# EAGLE design CS-O-BLINKER (EAGLE 6.4)
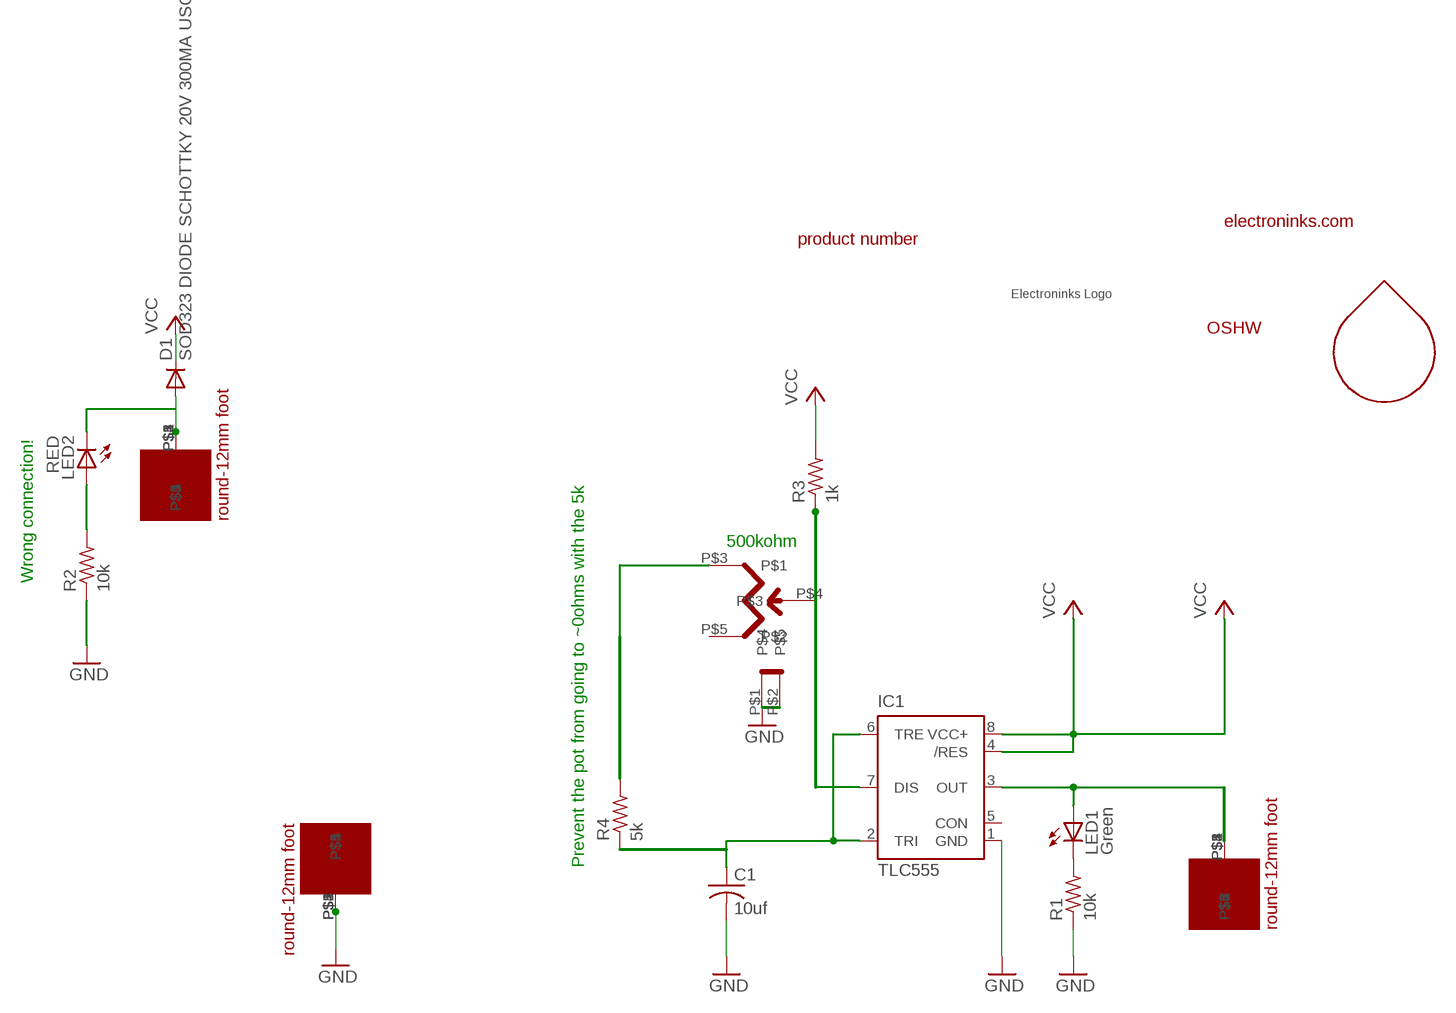
[diagram p0: schematic, sheet 1]

## Parts
C1  10uf  C-USC1206  [C1206]
D1  SOD323 DIODE SCHOTTKY 20V 300MA USC  DIODESOD  [SOD-323]
IC1  TLC555  NE555D  [SO08]
LED1  Green  LEDCHIP-LED0805  [CHIP-LED0805]
LED2  RED  LEDCHIP-LED0805  [CHIP-LED0805]
R1  10k  R-US_R0603  [R0603]
R2  10k  R-US_R0603  [R0603]
R3  1k  R-US_R0603  [R0603]
R4  5k  R-US_R0603  [R0603]
U$1  ROUND-12MM-FOOT-1.8MM  [ROUND-12MM-FOOT]
U$2  ROUND-12MM-FOOT-1.8MM  [ROUND-12MM-FOOT]
U$3  ROUND-12MM-FOOT-1.8MM  [ROUND-12MM-FOOT]
U$4  WH141-THUMB-POT-500K  [WH0141]
U$5  ELECTRONINKS_LOGO_10MM  [ELECTRONINKS_LOGO_10MM]
U$6  DROPLET_LOGO_3MM  [DROPLET_LOGO_3MM]
U$7  ELECTRONINKS_COM_15MM  [ELECTRONINKS_COM_15MM]
U$8  OSHW_3MM  [OSHW_3MM]
U$9  CS_N_BLINKER  [CS_N_BLINKER]

## Nets
GND: C1.2 IC1.1(GND) R1.1 R2.1 U$2.P$1 U$2.P$2 U$2.P$3 U$2.P$4 U$2.P$5 U$4.P$1 U$4.P$2
N$1: IC1.7(DIS) R3.1 U$4.P$4
N$2: C1.1 IC1.2(TRI) IC1.6(TRE) R4.1
N$3: IC1.3(OUT) LED1.A U$3.P$1 U$3.P$2 U$3.P$3 U$3.P$4 U$3.P$5
N$4: LED2.A R2.2
N$5: LED1.C R1.2
N$6: R4.2 U$4.P$3
N$7: D1.2(A) LED2.C U$1.P$1 U$1.P$2 U$1.P$3 U$1.P$4 U$1.P$5
VCC: D1.1(C) IC1.4(/RES) IC1.8(VCC+) R3.2
Unconnected: IC1.5(CON) U$4.P$5

## Notes on the sheet
- 500kohm
- Wrong connection!
- Prevent the pot from going to ~0ohms with the 5k

## Library data of the parts
C1 = resistor:C-US: CAPACITOR, American symbol
D1 = SparkFun-DiscreteSemi:DIODE: Diode These are standard reverse protection diodes and small signal diodes. SMA package can handle up to about 1A. SOD-323 can handle about 200mA. What the SOD-323 package when ordering, there are some mfgs out there that are 5-pin packages.; PROD_ID: DIO-09646
IC1 = SparkFun-AnalogIC:NE555: General purpose bipolar Timer
LED1 LED2 = led:LED: LED OSRAM: - CHIPLED LG R971, LG N971, LY N971, LG Q971, LY Q971, LO R971, LY R971 LH N974, LH R974 LS Q976, LO Q976, LY Q976 LO Q996 - Hyper CHIPLED LW Q18S LB Q993, LB Q99A, LB R99A - SideLED LS A670, LO A670, LY A670, LG A670, LP A670 LB A673, LV A673, LT A673, LW A673 LH A674 LY A675 LS A676, LA A676, LO A676, LY A676, LW A676 LS A679, LY A679, LG A679 - Hyper Micro SIDELED® LS Y876, LA Y876, LO Y876, LY Y876 LT Y87S - SmartLED LW L88C, LW L88S LB L89C, LB L89S, LG L890 LS L89K, LO L89K, LY L89K LS L896, LA L896, LO L896, LY L896 - TOPLED LS T670, LO T670, LY T670, LG T670, LP T670 LSG T670, LSP T670, LSY T670, LOP T670, LYG T670 LG T671, LOG T671, LSG T671 LB T673, LV T673, LT T673, LW T673 LH T674 LS T676, LA T676, LO T676, LY T676, LB T676, LH T676, LSB T676, LW T676 LB T67C, LV T67C, LT T67C, LS T67K, LO T67K, LY T67K, LW E67C LS E67B, LA E67B, LO E67B, LY E67B, LB E67C, LV E67C, LT E67C LW T67C LS T679, LY T679, LG T679 LS T770, LO T770, LY T770, LG T770, LP T770 LB T773, LV T773, LT T773, LW T773 LH T774 LS E675, LA E675, LY E675, LS T675 LS T776, LA T776, LO T776, LY T776, LB T776 LHGB T686 LT T68C, LB T68C - Hyper Mini TOPLED® LB M676 - Mini TOPLED Santana® LG M470 LS M47K, LO M47K, LY M47K Source: http://www.osram.convergy.de LUXEON: - LUMILED® LXK2-PW12-R00, LXK2-PW12-S00, LXK2-PW14-U00, LXK2-PW14-V00 LXK2-PM12-R00, LXK2-PM12-S00, LXK2-PM14-U00 LXK2-PE12-Q00, LXK2-PE12-R00, LXK2-PE12-S00, LXK2-PE14-T00, LXK2-PE14-U00 LXK2-PB12-K00, LXK2-PB12-L00, LXK2-PB12-M00, LXK2-PB14-N00, LXK2-PB14-P00, LXK2-PB14-Q00 LXK2-PR12-L00, LXK2-PR12-M00, LXK2-PR14-Q00, LXK2-PR14-R00 LXK2-PD12-Q00, LXK2-PD12-R00, LXK2-PD12-S00 LXK2-PH12-R00, LXK2-PH12-S00 LXK2-PL12-P00, LXK2-PL12-Q00, LXK2-PL12-R00 Source: www.luxeon.com KINGBRIGHT: KA-3528ASYC Source: www.kingbright.com
R1-R4 = resistor:R-US_: RESISTOR, American symbol
U$1-U$3 = electroninks:ROUND-12MM-FOOT-1.8MM
U$4 = electroninks:WH141-THUMB-POT-500K
U$5 = electroninks:ELECTRONINKS_LOGO_10MM
U$6 = electroninks:DROPLET_LOGO_3MM
U$7 = electroninks:ELECTRONINKS_COM_15MM
U$8 = electroninks:OSHW_3MM
U$9 = electroninks:CS_N_BLINKER

## Board
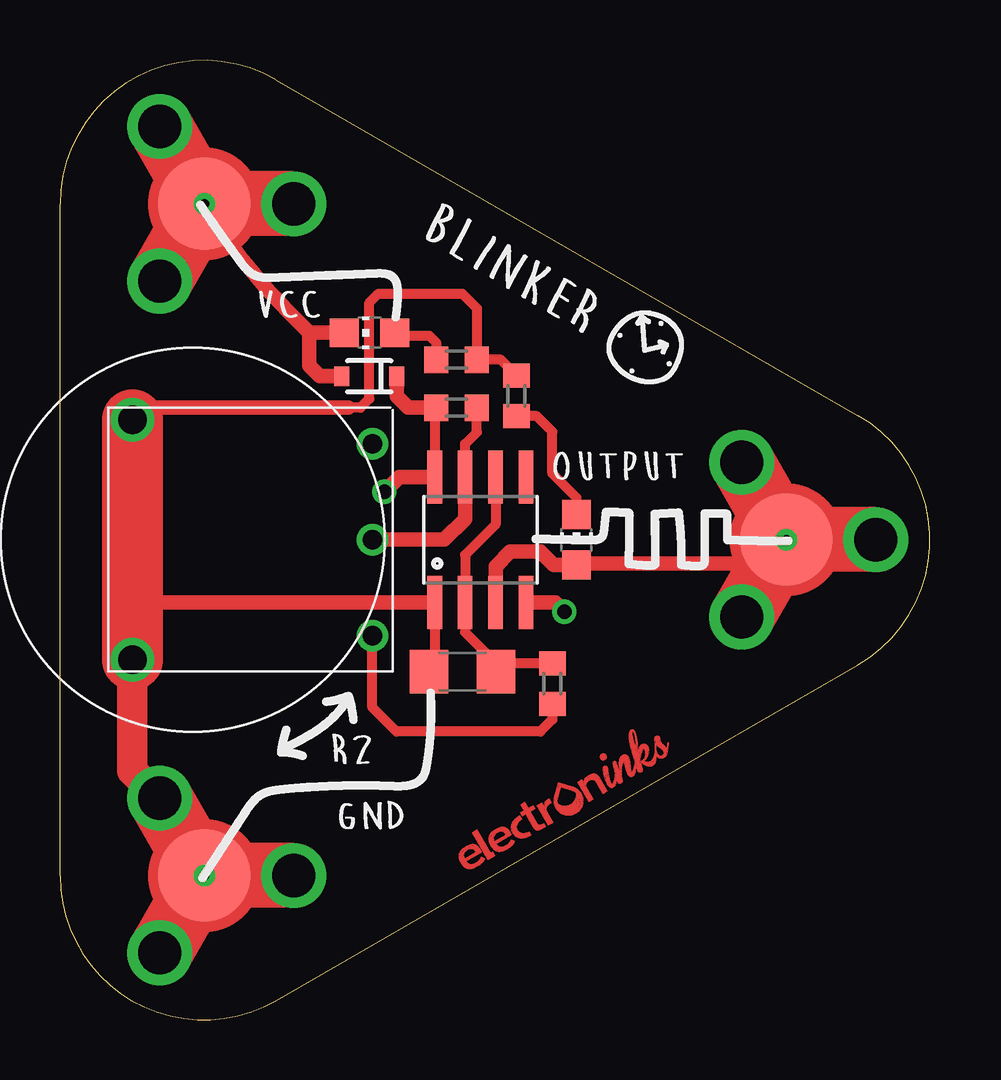
[diagram p1: board, top side]
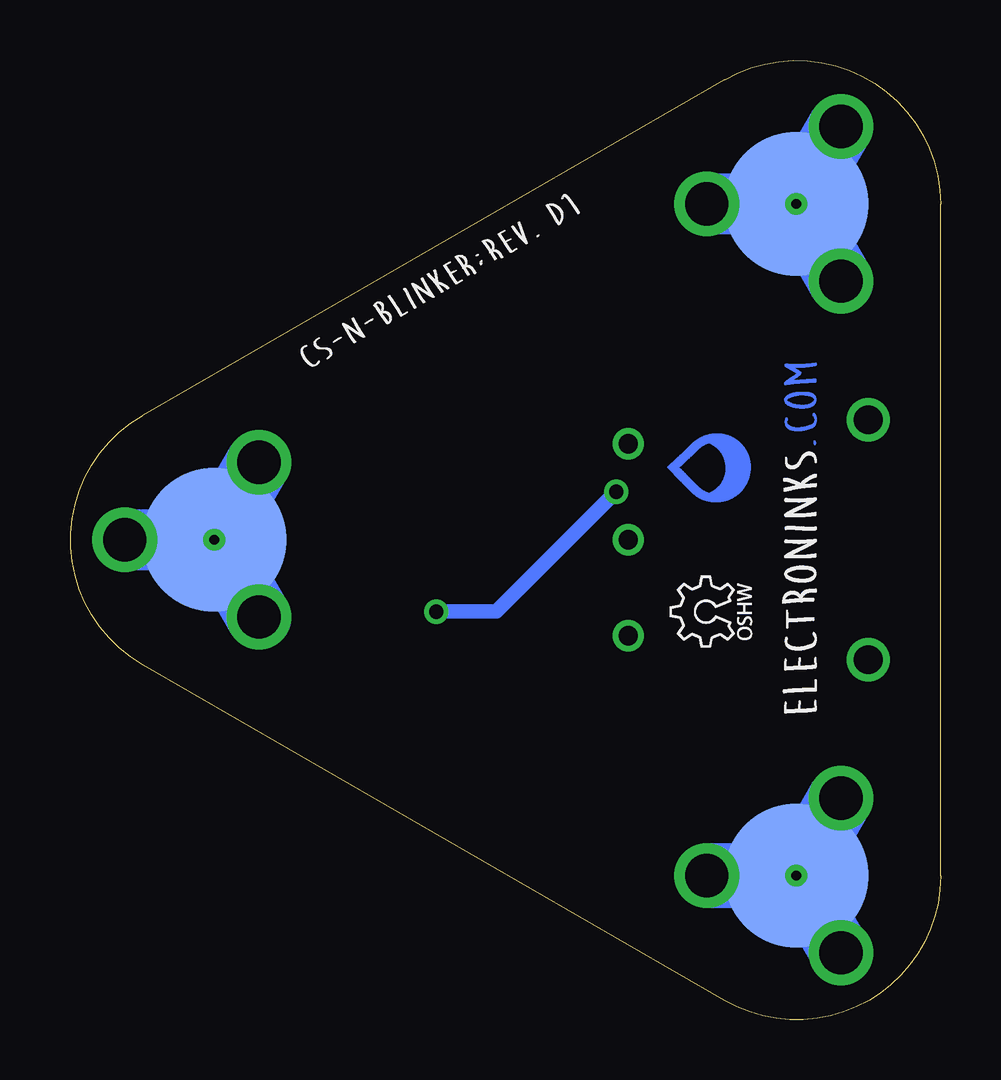
[diagram p2: board, bottom side, seen from below]

Size 36.24 x 39.99 mm. Coordinates in mm from the lower left corner, seen from the top.
Outline: 9,39.19 33.25,25.19 arc-120 33.25,14.8 9,0.8 arc-120 0,5.99 0,33.99 arc-120 9,39.19
Copper layers (1*16): Top 0.035mm / dielectric 1.5mm / Bottom 0.035mm
Design rules "default": minimum track width 10mil, minimum drill 0.6mm, track to track 8mil, track to pad 8mil, pad to pad 8mil, via to via 8mil, smd to smd 8mil, copper to edge 40mil, drill to drill 8mil, minimum pad ring 10mil, minimum via ring 8mil, stop-mask expansion 4mil, vias tented up to drill 0mil, thermal gap 10mil

### Footprints (pad centres in the part's own frame; a part is rotated, then mirrored left to right if it is on the bottom)
C1206 = smd 1.6 x 1.8: 1 -1.4,0; 2 1.4,0
SOD-323 = smd 0.63 x 0.83: 1 -1.15,0; 2 1.15,0
SO08 = smd 0.61 x 2.21: 1 -1.905,-2.616; 2 -0.635,-2.616; 3 0.635,-2.616; 4 1.905,-2.616; 5 1.905,2.616; 6 0.635,2.616; 7 -0.635,2.616; 8 -1.905,2.616
CHIP-LED0805 = smd 1.2 x 1.2: A 0,-1.05; C 0,1.05
R0603 = smd 1 x 1.1: 1 -0.85,0; 2 0.85,0
ROUND-12MM-FOOT = drill 1.8: P$1 -3.726,0; P$2 1.863,3.227; P$3 1.863,-3.227 | smd 3.85 x 3.85: P$4 0,0 | smd 6 x 6 bottom: P$5 0,0 | drill 0.4: P$6 0,0
WH0141 = drill 1.2: P$1 5,2.5; P$2 -5,2.5 | drill 0.8: P$3 -4,-7.5; P$4 0,-7.5; P$5 4,-7.5

### Placement (x,y rotation side)
C1  16.77,14.51 180 top
D1  12.89,26.82 180 top
IC1  17.52,20.01 0 top
LED1  21.52,20.01 0 top
LED2  12.89,28.64 90 top
R1  19.02,26.01 270 top
R2  16.52,27.51 180 top
R3  16.52,25.51 180 top
R4  20.52,14.01 270 top
U$1  6.02,34.01 180 top
U$2  6.02,6.01 60 top
U$3  30.27,20.01 180 top
U$4  5.52,20.01 90 top
U$5  17.02,6.01 30 top
U$6  9.02,23.01 90 bottom
U$7  4.77,12.51 90 bottom
U$8  7.64,15.51 90 bottom
U$9  26.27,26.76 30 bottom

### Tracks (layer width: path | path; a pad name or v marks a point on that pad's centre or on a via)
GND
  Top 0.406: R1.1 18.37,27.51 R2.1 17.37,29.66 16.77,30.26 13.27,30.26 12.89,29.89 12.89,25.89 12.52,25.51 12.02,25.51 | IC1.1 15.61,14.76 C1.2
  Top 0.61: IC1.1 3.13,17.4 3.02,17.51 | 12.02,25.51 3.52,25.51 arc90 U$4.P$1
  Top 1.27: U$4.P$2 3.02,10.38 U$2.P$2
  Top 2.54: U$4.P$1 3.02,17.51 U$4.P$2
N$1
  Top 0.406: IC1.7 16.88,24 17.37,24.49 R3.1
  Top 0.61: U$4.P$4 16.02,20.01 16.88,20.88 IC1.7
N$2
  Top 0.406: IC1.6 18.15,20.65 16.88,19.38 IC1.2 16.88,16.15 18.17,14.86 | R4.1 18.17,14.86 | 18.17,14.86 C1.1
N$3
  Top 0.61: IC1.3 18.15,18.9 18.77,19.51 20.02,19.51 20.57,18.96 LED1.A 21.57,19.01 29.02,19.01 U$3.P$5
N$4
  Top 0.406: LED2.A 14.07,28.51 15.39,28.51 15.67,28.24 R2.2
N$5
  Top 0.406: R1.2 19.87,25.16 20.52,24.51 20.52,22.76 21.52,21.76 LED1.C
N$6
  Top 0.406: R4.2 20.52,12.51 20.02,12.01 14.02,12.01 13.02,13.01 U$4.P$3
N$7
  Top 0.61: 11.74,28.64 LED2.C 10.39,28.64 | 10.39,28.64 9.52,29.51 arc-14 U$1.P$5 | D1.2 10.83,26.82 10.39,27.26 10.39,28.64
VCC  (via drill 0.6, 0.6 pad 0.61)
  Top 0.406: R3.2 15.61,25.46 IC1.8
  Top 0.61: IC1.4 20.63,17.4 v21.02,17.01 | D1.1 14.04,25.99 14.52,25.51 R3.2 | IC1.8 14.13,22.63 v13.52,22.01
  Bottom 0.61: v13.52,22.01 18.52,17.01 v21.02,17.01